# EasyEDA schematic SCH_camera mount detection_2024-06-10.json
TITLE: Sheet_1; REV: 1.0; Date: 2024-02-26; Sheet: 1/1; Drawn By: youssefokab; Company: Your Company
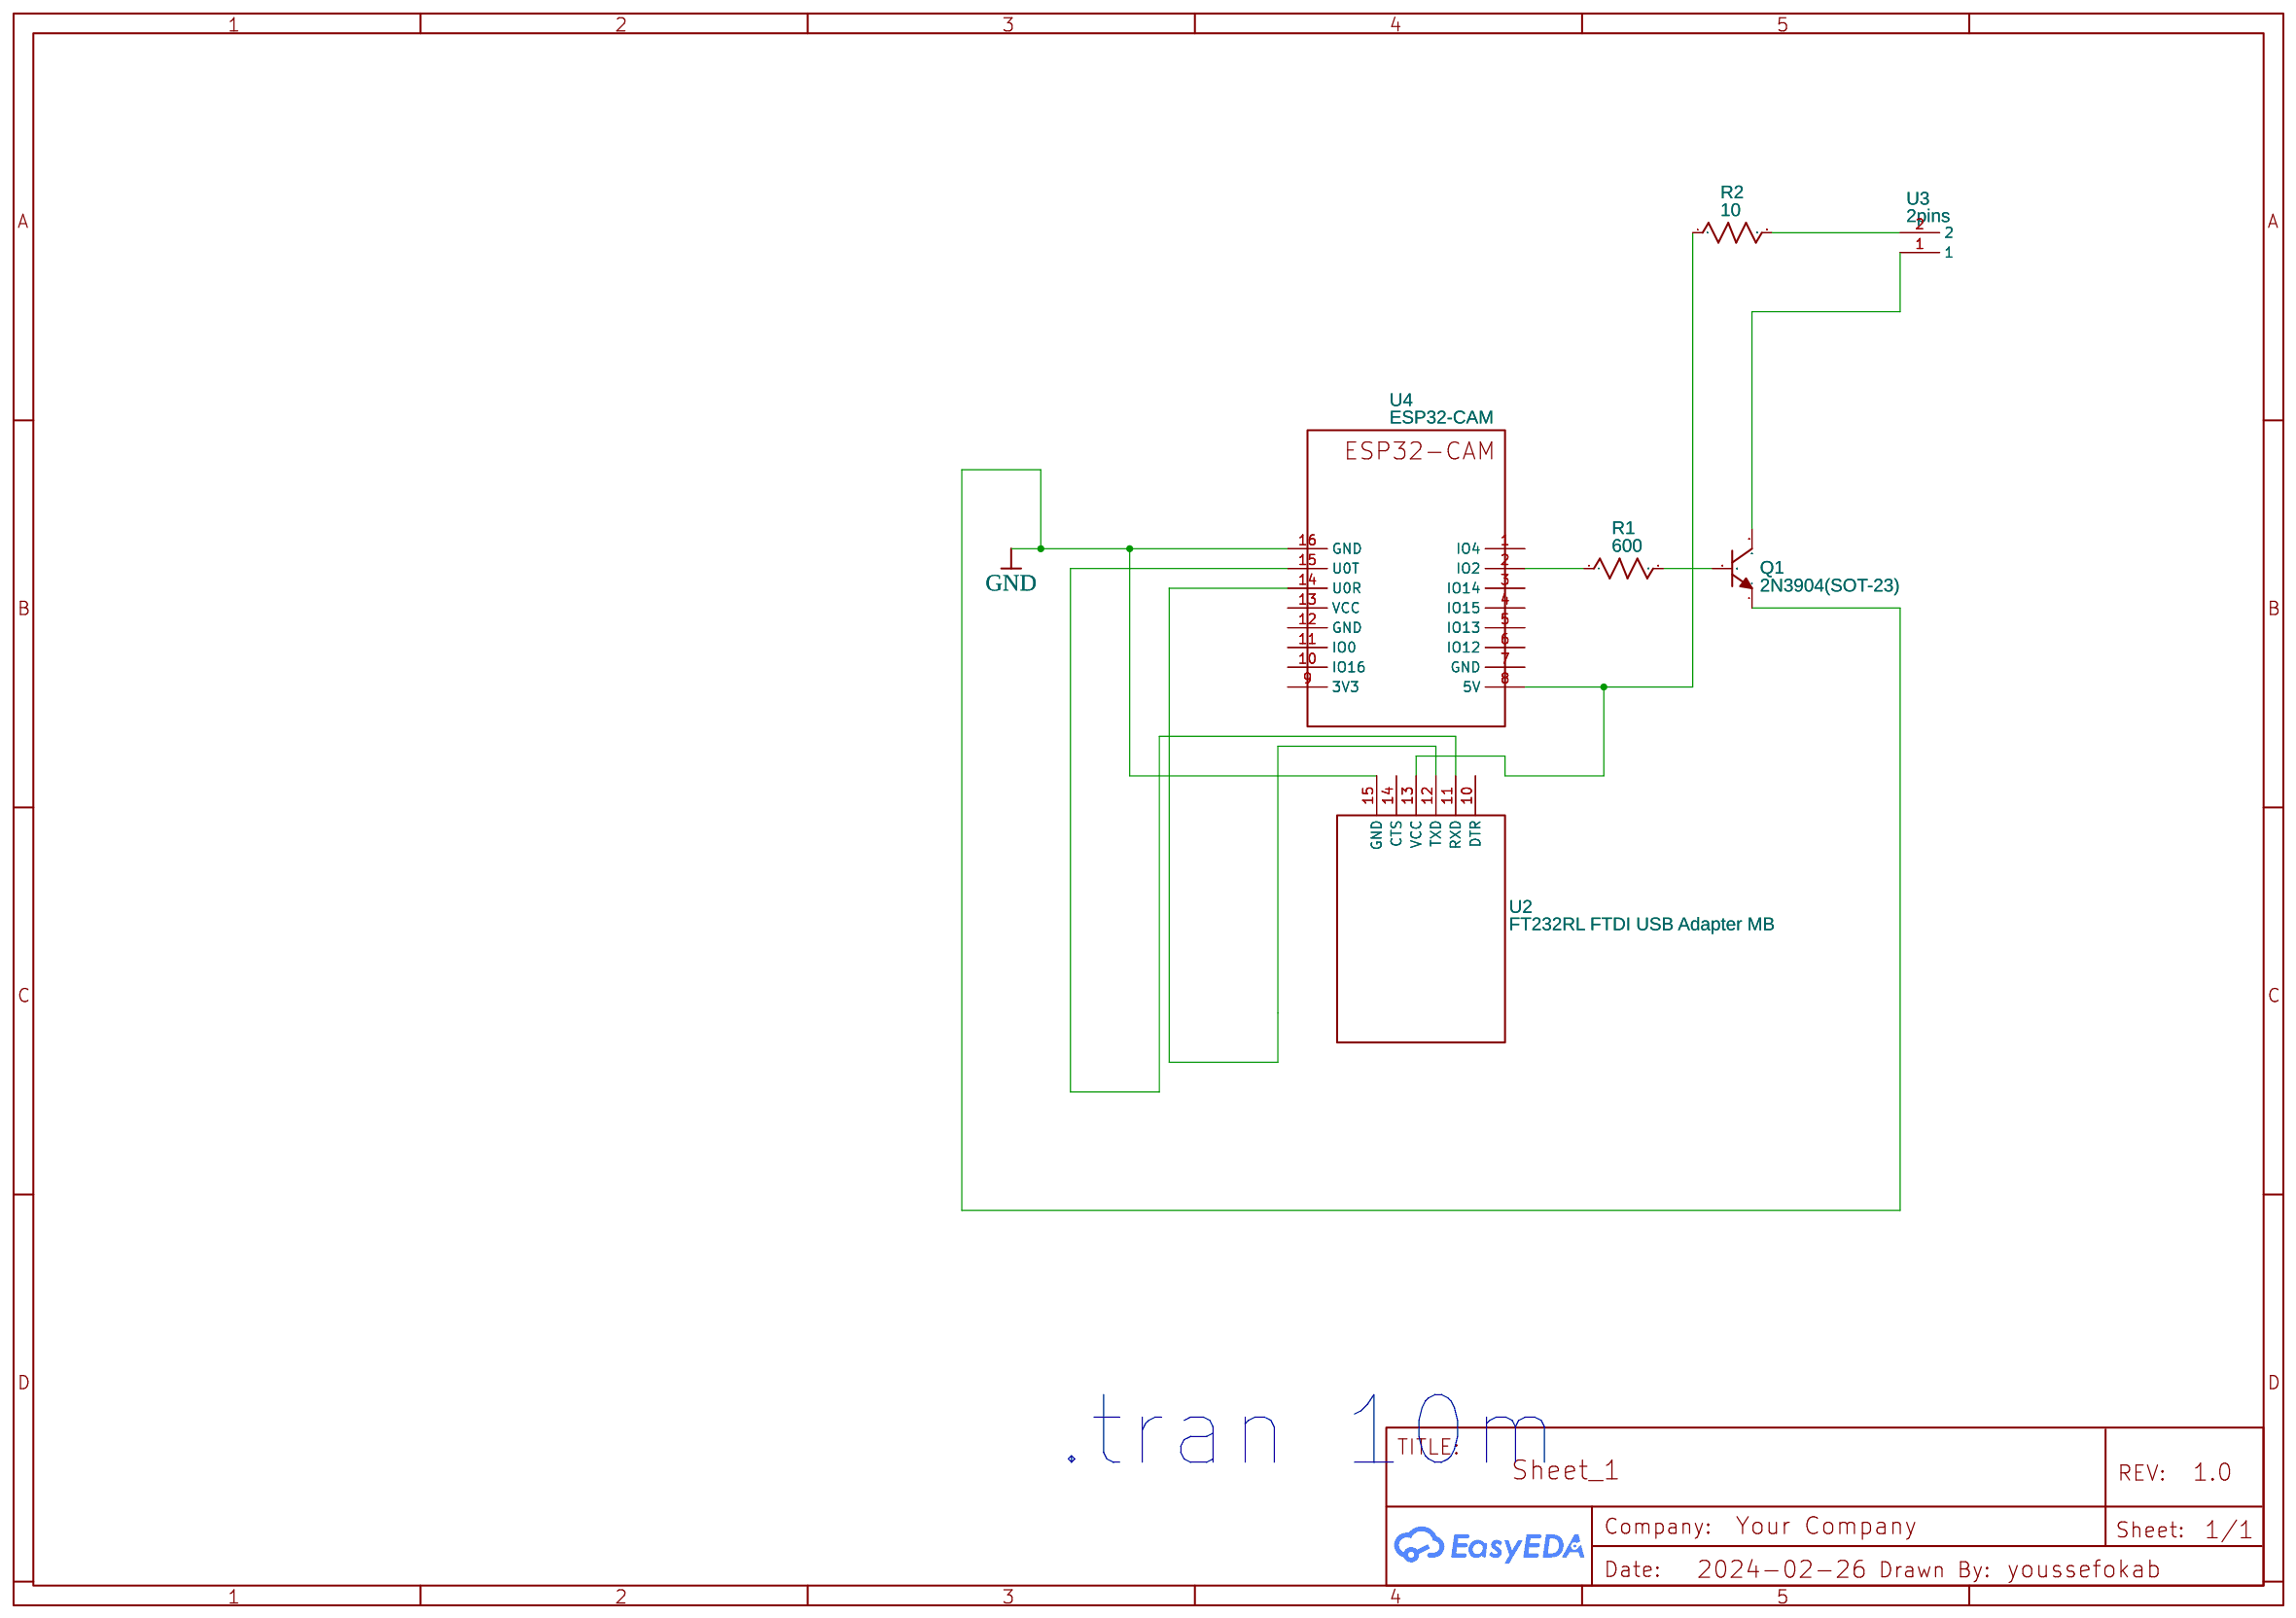
[diagram p0: schematic sheet]

## Parts
Q1  2N3904(SOT-23)  [SOT-23-3_L2.9-W1.3-P1.90-LS2.4-TR]
R1  600  [R0603]
R2  10  [R0603]
U2  FT232RL FTDI USB Adapter MB  [FT232RL FTDI USB TO 3.3V/5V TTL SERIAL CONVERTER ADAPTER MODULE]
U3  2pins  [2PINS]
U4  ESP32-CAM  [ESP32-CAM]

## Library data of the parts
Q1 = 2N3904(SOT-23): Supplier: LCSC; Manufacturer: KEC; Manufacturer Part: 2n3904S-RTK/PS; Supplier Part: C18536; Paste Type: SOT-23; Contributor: LCEDA_Lib
R1 R2 = R_0603_US: Contributor: LCEDA_Lib
U2 = FT232RL FTDI USB Adapter MB: link: https://www.banggood.com/FT232RL-FTDI-USB-To-TTL-Serial-Converter-Adapter-Module-For-Arduino-p-917226.html?; Contributor: mbokinala
U3 = 2pins: catid: 20; Contributor: drg_iulian; sim: true
U4 = ESP32-CAM: Supplier Part: undefined; link: https://lcsc.com/product-detail/Others_Ai-Thinker-ESP32-CAM_C277946.html; Contributor: ABDEL FETAH BOUSSIDA

## Nets
GND: Q1.1(E) U2.15(GND) U4.16(GND)
Net-(Q1-2): Q1.2(B) R1.2
Net-(Q1-3): Q1.3(C) U3.1
Net-(R1-1): R1.1 U4.2(IO2)
Net-(R2-1): R2.1 U2.13(VCC) U4.8(5V)
Net-(R2-2): R2.2 U3.2
Net-(U2-11): U2.11(RXD) U4.15(U0T)
Net-(U2-12): U2.12(TXD) U4.14(U0R)

Not connected (* = marked no-connect by the designer): U2 10(DTR) 14(CTS); U4 1(IO4) 3(IO14) 4(IO15) 5(IO13) 6(IO12) 7(GND) 9(3V3) 10(IO16) 11(IO0) 12(GND) 13(VCC)

## Notes on the sheet
- .tran 10m
